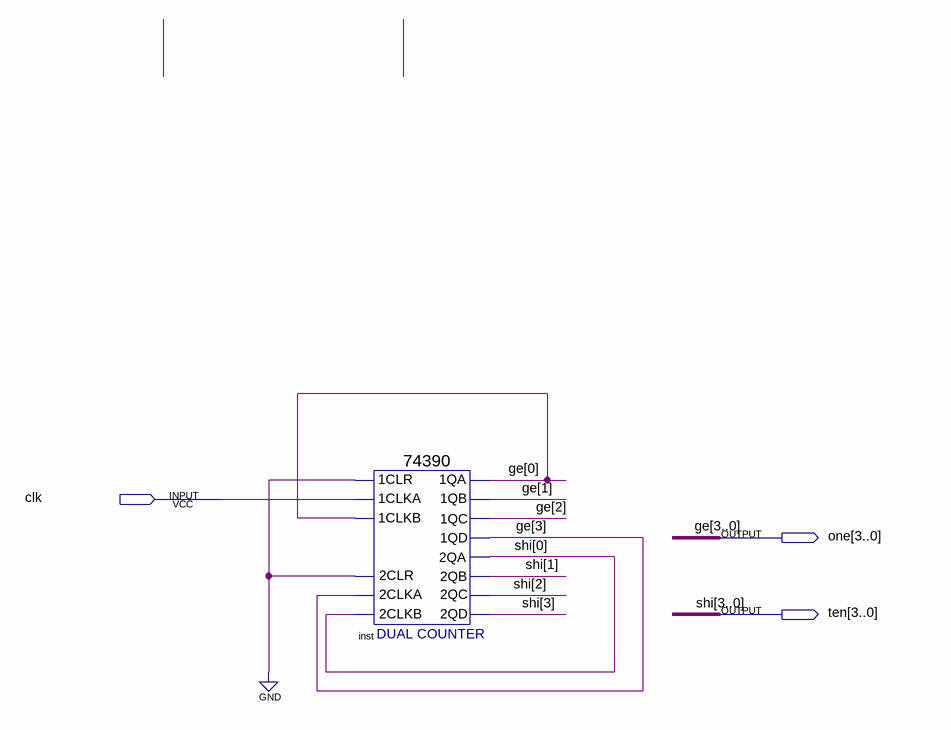
[diagram p0: schematic sheet]
// Quartus schematic cnt100.bdf as structural Verilog: 1 symbols, 3 pins
module cnt100 (
  input  clk,
  output [3:0] one,
  output [3:0] ten
);

  \74390  inst (
    .\2CLKA (one[3]), .\2CLR (1'b0), .\2CLKB (ten[0]), .\1CLR (1'b0), .\1CLKA (clk), .\1CLKB (one[0]),
    .\1QA (one[0]), .\1QB (one[1]), .\1QC (one[2]), .\1QD (one[3]), .\2QA (ten[0]), .\2QB (ten[1]),
    .\2QC (ten[2]), .\2QD (ten[3]));

  // Other names for the same wires on the sheet: ge[3:0] = one; shi[3:0] = ten
endmodule
